# Altium schematic sheet Sheet_1_2026-05-26.schdoc
size 218 x 161 mm
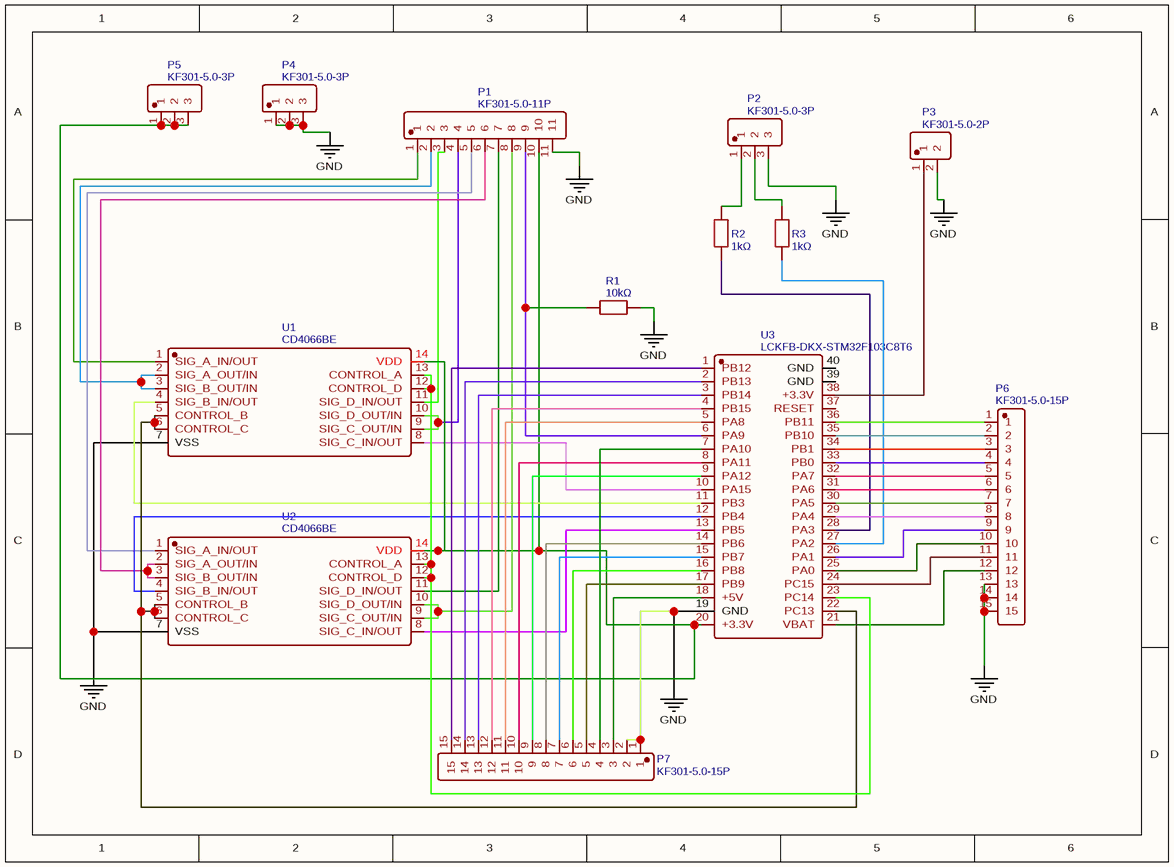
[diagram p0: Sheet_1_2026-05-26.schdoc]

## Parts
P1  KF301-5.0-11P  [CONN-TH_P5.00-11P_KF301-5.0]
P2  KF301-5.0-3P  [CONN-TH_3P-P5.00_KF301-5.0-3P]
P3  KF301-5.0-2P  [CONN-TH_P5.00_KF301-5.0-2P]
P4  KF301-5.0-3P  [CONN-TH_3P-P5.00_KF301-5.0-3P]
P5  KF301-5.0-3P  [CONN-TH_3P-P5.00_KF301-5.0-3P]
P6  KF301-5.0-15P  [CONN-TH_P5.00-15P_KF301-5.0]
P7  KF301-5.0-15P  [CONN-TH_P5.00-15P_KF301-5.0]
R1  10kΩ  [RES-TH_BD2.4-L6.3-P10.30-D0.6]
R2  1kΩ  [RES-TH_BD2.4-L6.3-P10.30-D0.6]
R3  1kΩ  [RES-TH_BD2.4-L6.3-P10.30-D0.6]
U1  CD4066BE  [DIP-14_L19.2-W6.6-P2.54-LS10.9-BL]
U2  CD4066BE  [DIP-14_L19.2-W6.6-P2.54-LS10.9-BL]
U3  LCKFB-DKX-STM32F103C8T6  [CONN-TH_L53.3-W22.9_STM32F103C8T6-CARD]

## Nets
GND: P1.11 P2.3 P3.2 P4.1 P4.2 P4.3 P6.13 P6.14 P6.15 P7.1 P7.2 R1.2 U1.7(VSS) U2.7(VSS) U3.19(GND)
NetP1_1: P1.1 U1.1(SIG_A_IN/OUT)
NetP1_2: P1.2 U1.2(SIG_A_OUT/IN) U1.3(SIG_B_OUT/IN)
NetP1_3: P1.3 U1.11(SIG_D_IN/OUT)
NetP1_4: P1.4 U1.9(SIG_C_OUT/IN) U1.10(SIG_D_OUT/IN)
NetP1_5: P1.5 U2.1(SIG_A_IN/OUT)
NetP1_6: P1.6 U2.2(SIG_A_OUT/IN) U2.3(SIG_B_OUT/IN)
NetP1_7: P1.7 U2.11(SIG_D_IN/OUT)
NetP1_8: P1.8 U2.9(SIG_C_OUT/IN) U2.10(SIG_D_OUT/IN)
NetP1_9: P1.9 R1.1 U3.6(PA9)
NetP1_10: P1.10 P5.1 P5.2 P5.3 U1.14(VDD) U2.14(VDD) U3.20(+3.3V)
NetP2_1: P2.1 R2.1
NetP2_2: P2.2 R3.1
NetP3_1: P3.1 U3.38(+3.3V)
NetP6_1: P6.1 U3.36(PB11)
NetP6_2: P6.2 U3.35(PB10)
NetP6_3: P6.3 U3.34(PB1)
NetP6_4: P6.4 U3.33(PB0)
NetP6_5: P6.5 U3.32(PA7)
NetP6_6: P6.6 U3.31(PA6)
NetP6_7: P6.7 U3.30(PA5)
NetP6_8: P6.8 U3.29(PA4)
NetP6_9: P6.9 U3.26(PA1)
NetP6_10: P6.10 U3.25(PA0)
NetP6_11: P6.11 U3.24(PC15)
NetP6_12: P6.12 U3.21(VBAT)
NetP7_3: P7.3 U3.18(+5V)
NetP7_4: P7.4 U3.7(PA10)
NetP7_5: P7.5 U3.17(PB9)
NetP7_6: P7.6 U3.16(PB8)
NetP7_7: P7.7 U3.15(PB7)
NetP7_8: P7.8 U3.14(PB6)
NetP7_9: P7.9 U3.9(PA12)
NetP7_10: P7.10 U3.8(PA11)
NetP7_11: P7.11 U3.5(PA8)
NetP7_12: P7.12 U3.4(PB15)
NetP7_13: P7.13 U3.3(PB14)
NetP7_14: P7.14 U3.2(PB13)
NetP7_15: P7.15 U3.1(PB12)
NetR2_2: R2.2 U3.28(PA3)
NetR3_2: R3.2 U3.27(PA2)
NetU1_4: U1.4(SIG_B_IN/OUT) U3.11(PB3)
NetU1_5: U1.5(CONTROL_B) U1.6(CONTROL_C) U2.5(CONTROL_B) U2.6(CONTROL_C) U3.22(PC13)
NetU1_8: U1.8(SIG_C_IN/OUT) U3.10(PA15)
NetU1_12: U1.12(CONTROL_D) U1.13(CONTROL_A) U2.12(CONTROL_D) U2.13(CONTROL_A) U3.23(PC14)
NetU2_4: U2.4(SIG_B_IN/OUT) U3.12(PB4)
NetU2_8: U2.8(SIG_C_IN/OUT) U3.13(PB5)

Not connected (* = marked no-connect by the designer): U3 37(RESET) 39(GND) 40(GND)

## Library data of the parts
P1 = KF301-5.0-11P: Manufacturer: null; Contributor: LCSC; Supplier: LCSC; Supplier Part: C9900001101; Manufacturer Part: KF301-5.0-11P; JLCPCB Part Class: Extended Part; spicePre: P; spiceSymbolName: KF301-5.0-11P
P2 P4 P5 = KF301-5.0-3P: Manufacturer: KEFA(科发); Contributor: LCSC; Supplier: LCSC; Supplier Part: C474882; Manufacturer Part: KF301-5.0-3P; JLCPCB Part Class: Extended Part; spicePre: U; spiceSymbolName: KF301-5.0-3P
P3 = KF301-5.0-2P: Manufacturer: KEFA(科发); Contributor: LCSC; Supplier: LCSC; Supplier Part: C474881; Manufacturer Part: KF301-5.0-2P; JLCPCB Part Class: Extended Part; spicePre: U; spiceSymbolName: KF301-5.0-2P
P6 P7 = KF301-5.0-15P: Manufacturer: null; Contributor: LCSC; Supplier: LCSC; Supplier Part: C9900001100; Manufacturer Part: KF301-5.0-15P; JLCPCB Part Class: Extended Part; spicePre: P; spiceSymbolName: KF301-5.0-15P
R1 = 10kΩ: Manufacturer: Tyohm(幸亚电阻); Manufacturer Part: RN1/4W10KFT/BA1; nameAlias: Value; Contributor: LCSC; Supplier: LCSC; Supplier Part: C410695; JLCPCB Part Class: Extended Part; spicePre: R; spiceSymbolName: RN 1/4W 10K F T/B A1
R2 R3 = 1kΩ: Manufacturer: Tyohm(幸亚电阻); Manufacturer Part: RN1/4W10KFT/BA1; nameAlias: Value; Contributor: LCSC; Supplier: LCSC; Supplier Part: C410695; JLCPCB Part Class: Extended Part; spicePre: R; spiceSymbolName: RN 1/4W 10K F T/B A1
U1 U2 = CD4066BE: Manufacturer: TI(德州仪器); sourceId: 8uoGAS9rJ; timeStamp: 1456627549; Supplier: LCSC; Manufacturer Part: CD4066BE; Supplier Part: C5203; JLCPCB Part Class: Extended Part; spicePre: U; spiceSymbolName: CD4066BE
U3 = LCKFB-DKX-STM32F103C8T6: Manufacturer: 立创开发板; Contributor: lcsc; Supplier: LCSC; Supplier Part: C22396880; Manufacturer Part: LCKFB-DKX-STM32F103C8T6; JLCPCB Part Class: Extended Part; spicePre: U; spiceSymbolName: LCKFB-DKX-STM32F103C8T6